# EasyEDA Pro project NavBot-EN01.epro, schematic CODER

## Sheets
1 P1: Board Name: CODER; Create Date: 2025-05-14; Page Name: P1; Project Name: NavBot-EN01; Schematic Name: CODER; Update Date: 2025-07-09; Add into BOM: yes; Convert to PCB: yes; Date: 2021-01-13; Draw By: MUSHIBO; REV: 1.0; Sheet: 1/1
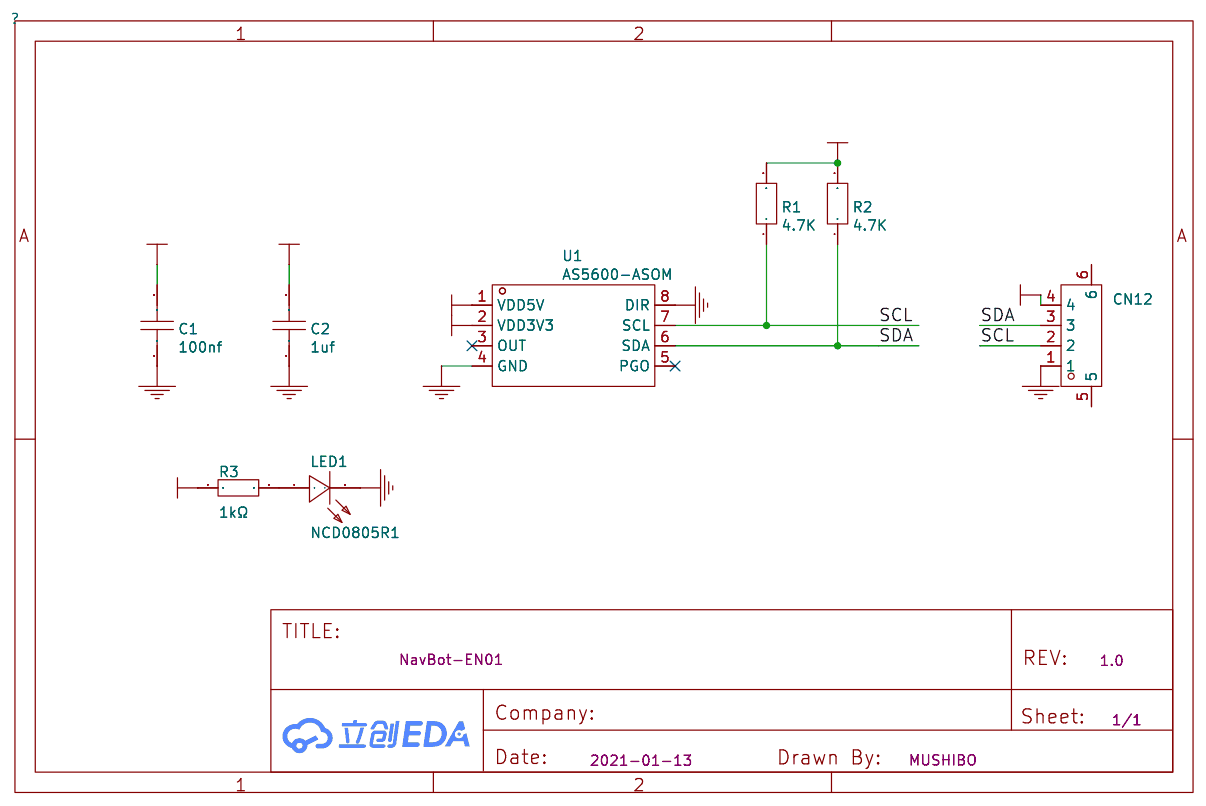
[diagram p0: P1]
2 版本说明: Create Date: 2025-07-21; Page Name: 版本说明; Update Date: 2025-07-21; Company: 嘉立创EDA; Page Size: A4; Version: V1.0
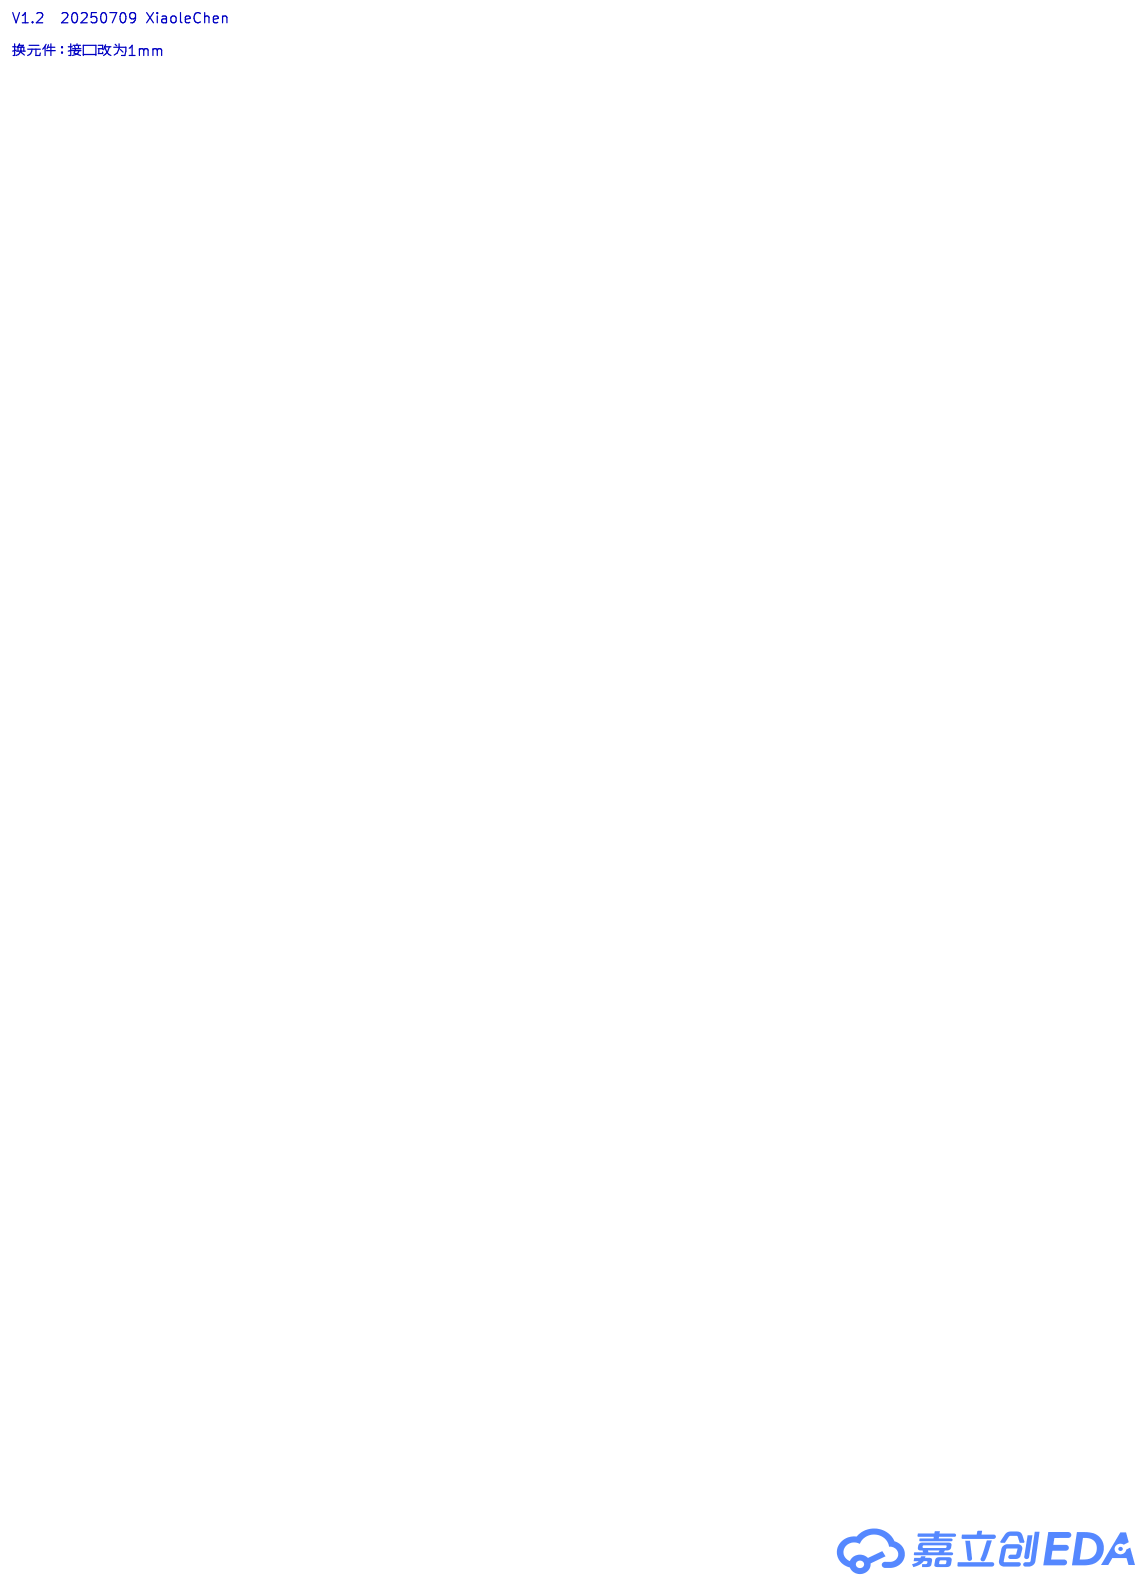
[diagram p1: 版本说明]

## Parts
C1  100nf  [C0603]
C2  1uf  [C0603]
CN12  WAFER-SH1.0-4PWB  [CONN-SMD_4P-P1.00_WAFER-SH1.0-4PWB]
LED1  NCD0805R1  [LED0805-R-RD]
R1  4.7K  [R0603]
R2  4.7K  [R0603]
R3  1kΩ  [R0603]
U1  AS5600-ASOM  [SOIC-8_L5.0-W4.0-P1.27-LS6.0-BL]

## Library data of the parts
C1 = 100nf: link: https://item.szlcsc.com/362304.html; 3DModel: C0603_L1.6-W0.8-H0.8
C2 = 1uf: link: https://item.szlcsc.com/362304.html; 3DModel: C0603_L1.6-W0.8-H0.8
CN12 = WAFER-SH1.0-4PWB: 插针结构:1x4P;间距:1mm;安装方式:卧贴;参考系列:SH;总PIN数:4P;排数:1;每排PIN数:4;行距:-;额定电流:1A;触头材质:黄铜;触头镀层:-;工作温度:-25℃~+85℃;; LCSC Part Name: 1x4P 间距:1mm 卧贴 系列:SH; Supplier Part: C3029343; Manufacturer: XUNPU(讯普); Supplier Footprint: SMD,P=1mm,卧贴; JLCPCB Part Class: 扩展库; Datasheet: https://atta.szlcsc.com/upload/public/pdf/source/20220527/1879B8210BD3B2006BCEAC1A40D397B6.pdf; Supplier: LCSC; Pins Structure: 1x4P; Pitch: 1mm; Mounting Type: 卧贴; Reference Series: SH; Number of Pins: 4P; Number of Rows: 1; Number of PINs Per Row: 4; Current Rating: 1A; Contact Material: 黄铜; Operating Temperature: -25℃~+85℃; Voltage Rating: 50V; Plastic Material: LCP; Supplementary Features: 辅助焊脚; Color: 米色; Z-Height of the Board: 3.15mm; X-Length of Bottom Edge on Board (Spacing Line): 6.35mm; Y-Width of Bottom Edge on Board: 5.05mm
LED1 = NCD0805R1: 灯头类型:-;发光颜色:红色;正向电压(VF):1.6V~2.6V;功率:65mW;正向电流:20mA;主波长:615nm~630nm;二极管配置:独立二极管;透镜颜色:无色透明透镜;色温:-;发光强度:67mcd~195mcd;发光角度:130°;载带方式:-;工作温度:-30℃~+85℃;; Supplier Part: C84256; Manufacturer: 国星光电; Supplier Footprint: 0805; JLCPCB Part Class: 基础库; Datasheet: https://atta.szlcsc.com/upload/public/pdf/source/20200820/C84256_F0A75A43B3EAD75808600A0514C76B99.pdf; Supplier: LCSC; Emitted Color: 红色; Forward Voltage (VF): 1.6V~2.6V; Power Dissipation: 65mW; Forward Current: 20mA; Dominant Wavelength: 615nm~630nm; Diode Configuration: 独立二极管; Lens Color: 无色透明透镜; Luminous Intensity: 67mcd~195mcd; Viewing Angle: 130°; Operating Temperature: -30℃~+85℃
R1 R2 = 4.7K: link: https://item.szlcsc.com/137208.html; 3DModel: R0603_L1.6-W0.8-H0.8
R3 = 0603WAF1001T5E: 电阻类型:厚膜电阻;阻值:1kΩ;精度:±1%;功率:100mW;最大工作电压:75V;温度系数:±100ppm/℃;; LCSC Part Name: 1kΩ ±1% 100mW 厚膜电阻; Supplier Part: C21190; Manufacturer: UNI-ROYAL(厚声); Supplier Footprint: 0603; JLCPCB Part Class: 基础库; Datasheet: https://atta.szlcsc.com/upload/public/pdf/source/20200306/C422600_1E6D84923E4A46A82E41ADD87F860B5C.pdf; Supplier: LCSC; Type: 厚膜电阻; Tolerance: ±1%; Power(Watts): 100mW; Overload Voltage (Max): 75V; Temperature Coefficient: ±100ppm/℃; Operating Temperature Range: -55℃~+155℃
U1 = AS5600-ASOM: link: https://item.szlcsc.com/417287.html; 3DModel: SOIC-8_L4.9-W3.9-H1.7-LS6.0-P1.27; Supplier: LCSC; Manufacturer: Ams; Supplier Part: C79815; JLCPCB Part Class: Extended Part; JLCPCB SMD: Yes

## Nets
GND: C1.1 C2.1 CN12.1 LED1.2(-) U1.4(GND) U1.8(DIR)
VCC: C1.2 CN12.4 R1.2 R2.2 R3.1 U1.1(VDD5V)
VCC3.3: C2.2 U1.2(VDD3V3)
SCL: CN12.2 R1.1 U1.7(SCL)
SDA: CN12.3 R2.1 U1.6(SDA)
$1N565: LED1.1(+) R3.2

Not connected (* = marked no-connect by the designer): CN12 5 6; U1 3(OUT)* 5(PGO)*

## Notes on the sheets
sheet 2
- V1.2  20250709 XiaoleChen
  换元件：接口改为1mm
